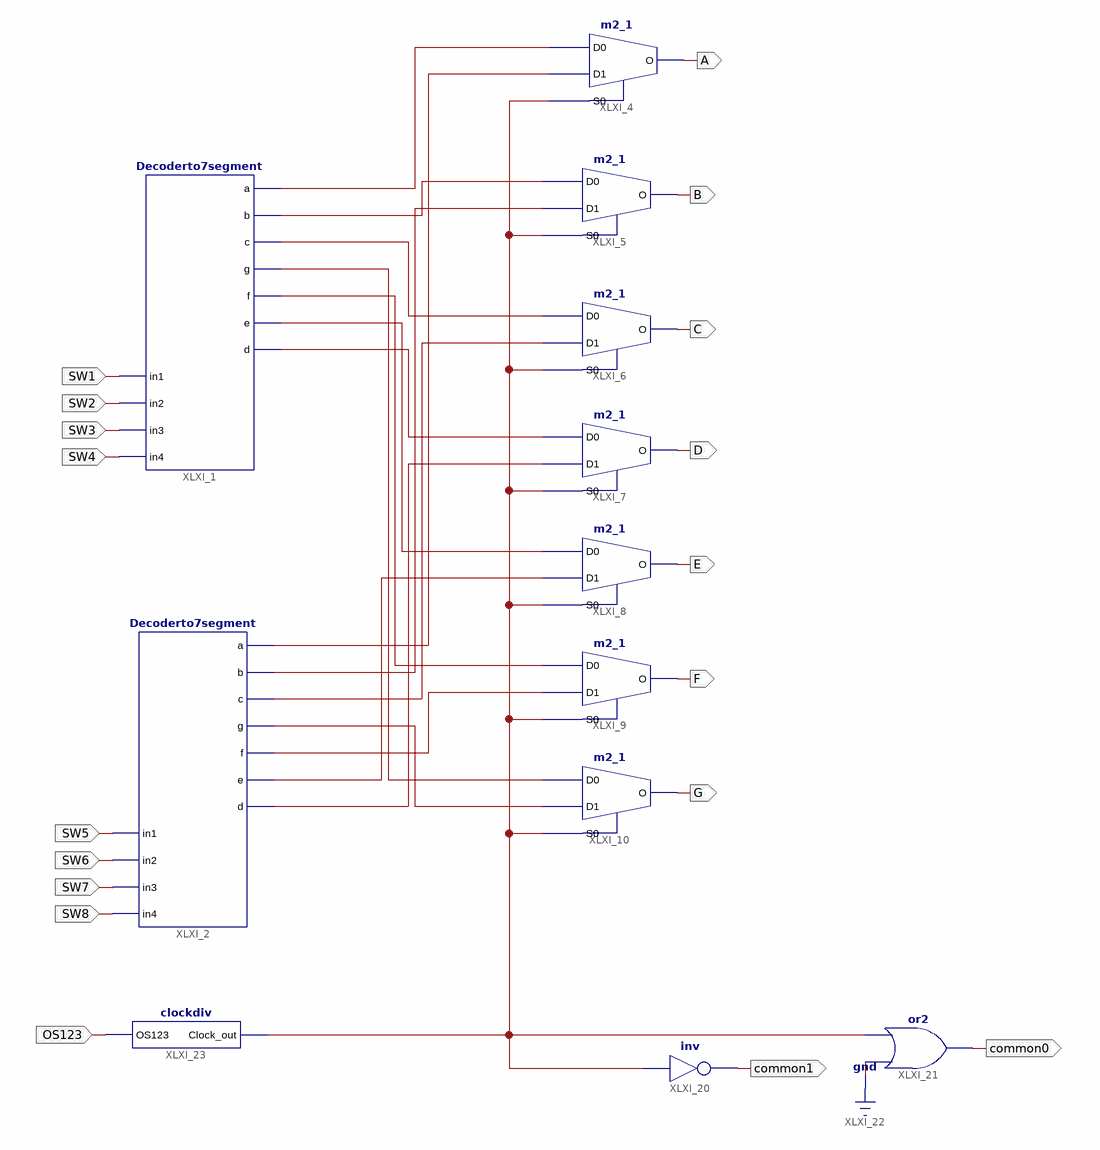
[diagram p0: schematic sheet 1]
// Xilinx ISE schematic multisegment.sch (spartan6) as structural Verilog: 12 symbols, 18 ports
module multisegment (
  input  SW1,
  input  SW2,
  input  SW3,
  input  SW4,
  input  SW5,
  input  SW6,
  input  SW7,
  input  SW8,
  input  OS123,
  output A,
  output B,
  output C,
  output D,
  output E,
  output F,
  output G,
  output common1,
  output common0
);

  wire Clock_in, XLXN_9, XLXN_10, XLXN_11, XLXN_12, XLXN_13, XLXN_14, XLXN_15, XLXN_16, XLXN_17, XLXN_18,
       XLXN_19, XLXN_20, XLXN_21, XLXN_22;

  Decoderto7segment XLXI_1 (
    .in1(SW1), .in2(SW2), .in3(SW3), .in4(SW4), .a(XLXN_9), .b(XLXN_10), .c(XLXN_11), .g(XLXN_15),
    .f(XLXN_14), .e(XLXN_13), .d(XLXN_12));
  Decoderto7segment XLXI_2 (
    .in1(SW5), .in2(SW6), .in3(SW7), .in4(SW8), .a(XLXN_16), .b(XLXN_17), .c(XLXN_18), .g(XLXN_22),
    .f(XLXN_21), .e(XLXN_20), .d(XLXN_19));
  m2_1 XLXI_4 (.D0(XLXN_9), .D1(XLXN_16), .S0(Clock_in), .O(A));
  m2_1 XLXI_5 (.D0(XLXN_10), .D1(XLXN_17), .S0(Clock_in), .O(B));
  m2_1 XLXI_6 (.D0(XLXN_11), .D1(XLXN_18), .S0(Clock_in), .O(C));
  m2_1 XLXI_7 (.D0(XLXN_12), .D1(XLXN_19), .S0(Clock_in), .O(D));
  m2_1 XLXI_8 (.D0(XLXN_13), .D1(XLXN_20), .S0(Clock_in), .O(E));
  m2_1 XLXI_9 (.D0(XLXN_14), .D1(XLXN_21), .S0(Clock_in), .O(F));
  m2_1 XLXI_10 (.D0(XLXN_15), .D1(XLXN_22), .S0(Clock_in), .O(G));
  not XLXI_20 (common1, Clock_in);
  or XLXI_21 (common0, 1'b0, Clock_in);
  clockdiv XLXI_23 (.OS123(OS123), .Clock_out(Clock_in));
endmodule
